# EAGLE design Millable_TitanX1_GPS_Breakout (EAGLE 7.7.0)
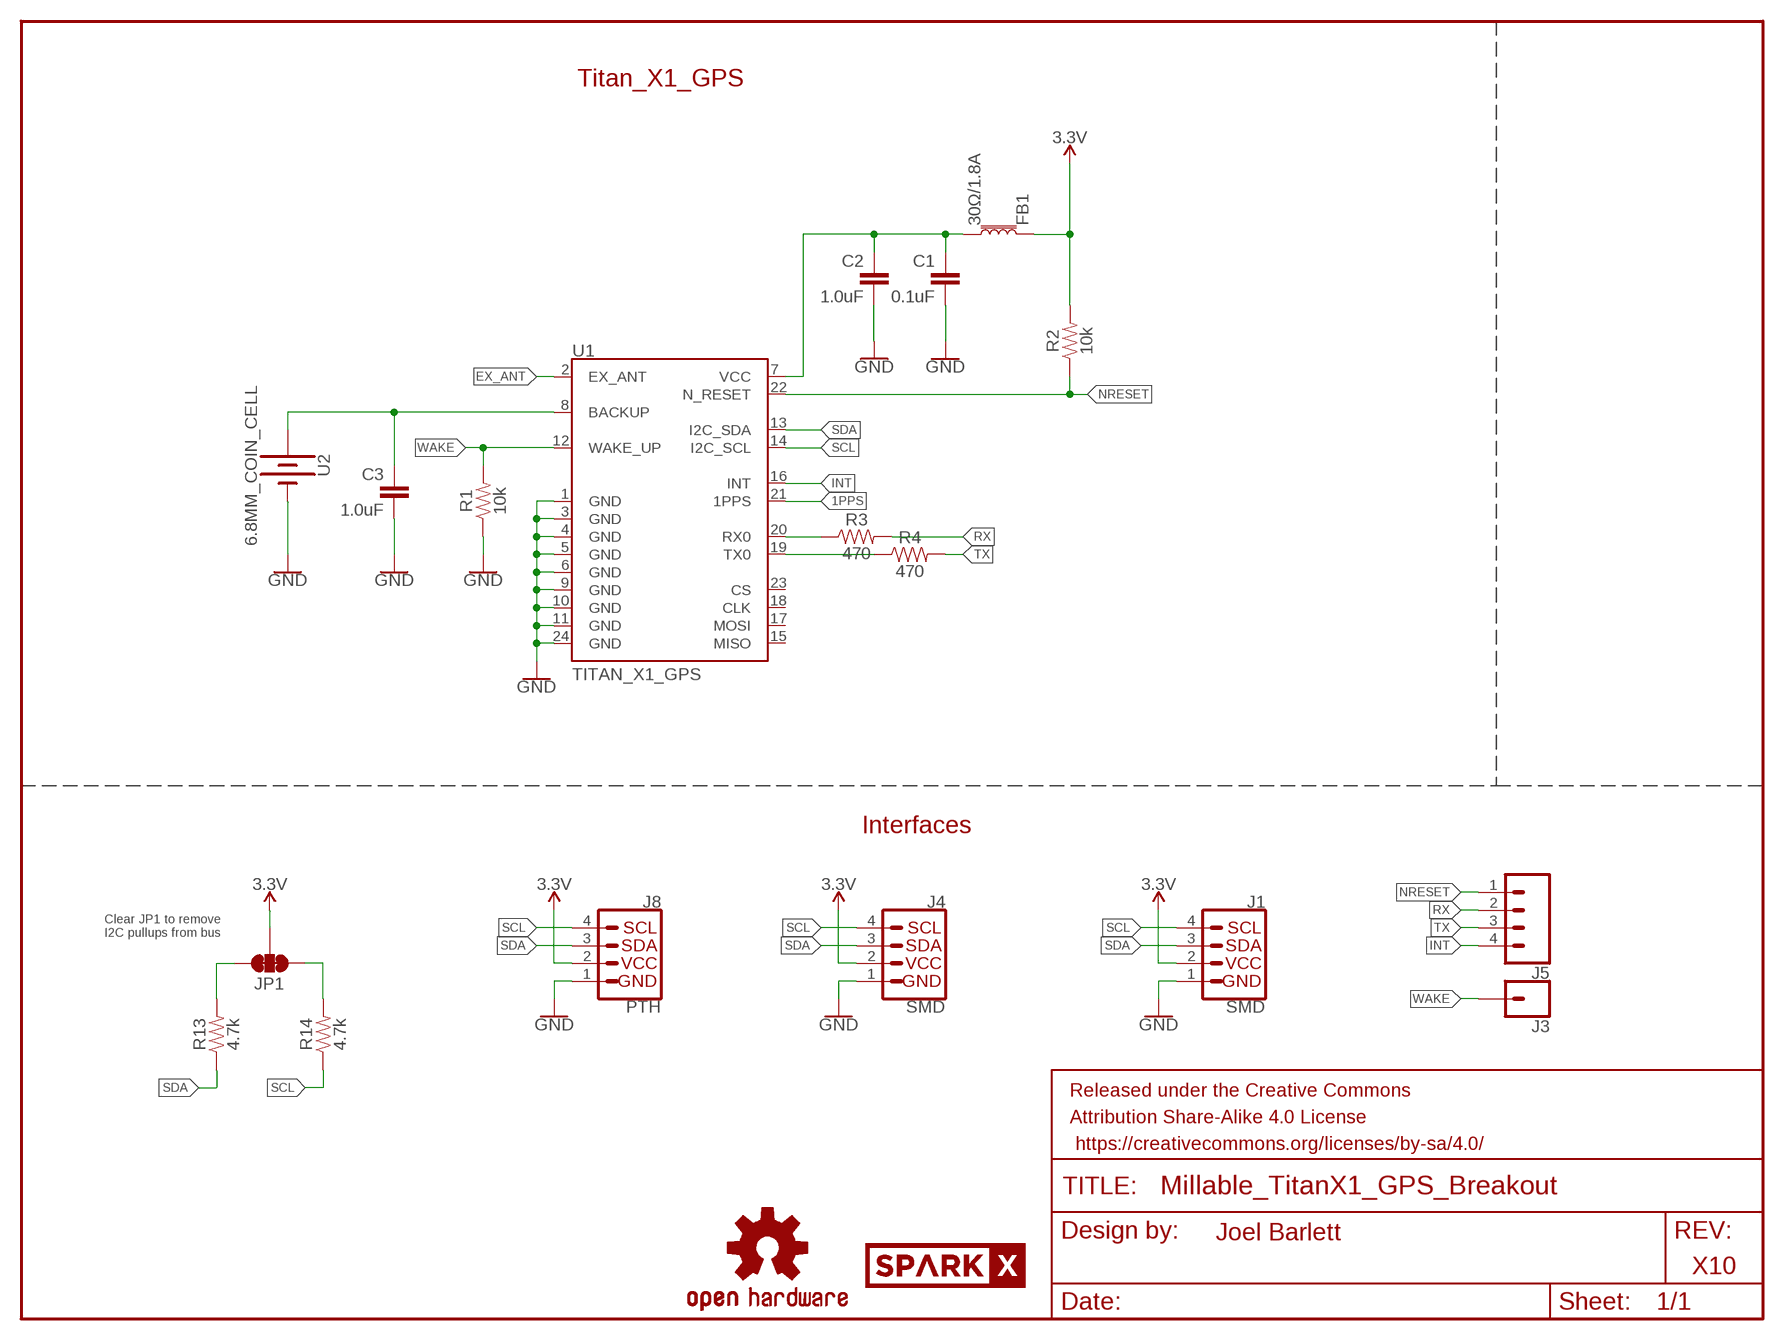
[diagram p0: schematic, sheet 1]

## Parts
C1  0.1uF  0.1UF-0603-25V-(+80/-20%)  [0603]
C2  1.0uF  1.0UF-0603-16V-10%  [0603]
C3  1.0uF  1.0UF-0603-16V-10%  [0603]
FB1  30Ω/1.8A  FERRITE_BEAD-0603  [0603]
FRAME1  FRAME-LETTER  [CREATIVE_COMMONS]
J1  SMD  I2C_STANDARDJS-1MM  [1X04_1MM_RA]
J3  CONN_01PTH_NO_SILK_YES_STOP  [1X01_NO_SILK]
J4  SMD  I2C_STANDARDJS-1MM  [1X04_1MM_RA]
J5  CONN_041X04_NO_SILK  [1X04_NO_SILK]
J8  PTH  I2C_STANDARD_NO_SILK  [1X04_NO_SILK]
JP1  JUMPER-SMT_3_2-NC_TRACE_SILK  [SMT-JUMPER_3_2-NC_TRACE_SILK]
LOGO4  OSHW-LOGOS  [OSHW-LOGO-S]
R1  10k  10KOHM-0603-1/10W-1%  [0603]
R2  10k  10KOHM-0603-1/10W-1%  [0603]
R3  470  470OHM-0603-1/10W-1%  [0603]
R4  470  470OHM-0603-1/10W-1%  [0603]
R13  4.7k  4.7KOHM-0603-1/10W-1%  [0603]
R14  4.7k  4.7KOHM-0603-1/10W-1%  [0603]
U1  TITAN_X1_GPS  [TITAN_X1_GPS]
U2  6.8MM_COIN_CELL  [6.8MM_COIN_CELL]
U$1  SPARKX-LOGO3  [SPARKX-SMALL]

## Nets
1PPS: U1.21(1PPS)
3.3V: FB1.1 J1.2(VCC) J4.2(VCC) J8.2 JP1.2 R2.2
EX_ANT: U1.2(EX_ANT)
GND: C1.2 C2.2 C3.2 J1.1(GND) J4.1(GND) J8.1 R1.1 U1.1(GND) U1.3(GND) U1.4(GND) U1.5(GND) U1.6(GND) U1.9(GND) U1.10(GND) U1.11(GND) U1.24(GND) U2.-
INT: J5.4 U1.16(INT)
N$1: C3.1 U1.8(BACKUP) U2.+
N$3: R3.1 U1.20(RX0)
N$4: JP1.3 R13.2
N$5: JP1.1 R14.2
N$6: R4.1 U1.19(TX0)
N$7: C1.1 C2.1 FB1.2 U1.7(VCC)
NRESET: J5.1 R2.1 U1.22(N_RESET)
RX: J5.2 R3.2
SCL: J1.4(SCL) J4.4(SCL) J8.4 R14.1 U1.14(I2C_SCL)
SDA: J1.3(SDA) J4.3(SDA) J8.3 R13.1 U1.13(I2C_SDA)
TX: J5.3 R4.2
WAKE: J3.1 R1.2 U1.12(WAKE_UP)
Unconnected: U1.15(MISO) U1.17(MOSI) U1.18(CLK) U1.23(CS)

## Notes on the sheet
- Titan_X1_GPS
- Interfaces
- Clear JP1 to remove
  I2C pullups from bus
- Joel Barlett
- X10

## Library data of the parts
C1 = SparkFun-Capacitors:0.1UF: 0.1µF ceramic capacitors A capacitor is a passive two-terminal electrical component used to store electrical energy temporarily in an electric field.; PROD_ID: CAP-00810
C2 C3 = SparkFun-Capacitors:1.0UF: 1µF ceramic capacitors A capacitor is a passive two-terminal electrical component used to store electrical energy temporarily in an electric field.; PROD_ID: CAP-00868
FB1 = SparkFun-Coils:FERRITE_BEAD: Ferrite Bead (blocks, cores, rings, chokes, etc.) Inductor with layers of ferrite used to suppress high frequencies. Often used to isolate high frequency noise. SparkFun Products: IOIO-OTG - V2.2 <https://www.sparkfun.com/products/13613> SparkFun SAMD21 Mini Breakout <https://www.sparkfun.com/products/13664> SparkFun 6 Degrees of Freedom Breakout - LSM6DS3 <https://www.sparkfun.com/products/13339> SparkFun SAMD21 Dev Breakout <https://www.sparkfun.com/products/13672>; PROD_ID: NDUC-07859
FRAME1 = SparkFun-Aesthetics:FRAME-LETTER: Schematic Frame - Letter Standard 8.5x11 US Letter frame
J1 J4 = SparkX:I2C_STANDARD: SparkFun I2C Standard Pinout Header SparkFun has standardized on a pinout for all I2C based sensor breakouts. This pinout allows I2C boards to be plugged directly into the headers on Arduino Uno compatible boards, and to be daisy chained easily. Example SparkFun Products: SparkFun Atmospheric Sensor Breakout - BME280 <https://www.sparkfun.com/products/13676> SparkFun Altitude/Pressure Sensor Breakout - MPL3115A2 <https://www.sparkfun.com/products/11084> SparkFun TOF Range Finder Sensor - VL6180 <https://www.sparkfun.com/products/12785>
J3 = SparkFun-Connectors:CONN_01: Single connection point. Often used as Generic Header-pin footprint for 0.1 inch spaced/style header connections On any of the 0.1 inch spaced packages, you can populate with these: Break Away Headers - Straight <https://www.sparkfun.com/products/116> (PRT-00116) Break Away Male Headers - Right Angle <https://www.sparkfun.com/products/553> (PRT-00553) Female Headers <https://www.sparkfun.com/products/115> (PRT-00115) Break Away Headers - Machine Pin <https://www.sparkfun.com/products/117> (PRT-00117) Break Away Female Headers - Swiss Machine Pin <https://www.sparkfun.com/products/743> (PRT-00743) This device is also useful as a general connection point to wire up your design to another part of your project. Our various solder wires solder well into these plated through hole pads. Hook-Up Wire - Assortment (Stranded, 22 AWG) <https://www.sparkfun.com/products/11375> (PRT-11375) Hook-Up Wire - Assortment (Solid Core, 22 AWG) <https://www.sparkfun.com/products/11367> (PRT-11367) View the entire wire category on our website here <https://www.sparkfun.com/categories/141> Special notes: SMTSO-256-ET is a "flush mount" nut for a 4-40 screw. We mostly use this on specialty testbeds; it is a nice way to connect hardware to your PCB at an adjustable hieght. Also note, the SNAP packages are for using a snappable style connector. We sell a baggie of snaps and they are also used on two LilyPad designs: Snap Assortment - 30 pack (male and female) <https://www.sparkfun.com/products/11347> (DEV-11347) LilyPad Arduino SimpleSnap <https://www.sparkfun.com/products/10941> (DEV-10941) LilyPad SimpleSnap Protoboard <https://www.sparkfun.com/products/10940> (DEV-10940)
J5 = SparkFun-Connectors:CONN_04: Multi connection point. Often used as Generic Header-pin footprint for 0.1 inch spaced/style header connections On any of the 0.1 inch spaced packages, you can populate with these: Break Away Headers - Straight <https://www.sparkfun.com/products/116> (PRT-00116) Break Away Male Headers - Right Angle <https://www.sparkfun.com/products/553> (PRT-00553) Female Headers <https://www.sparkfun.com/products/115> (PRT-00115) Break Away Headers - Machine Pin <https://www.sparkfun.com/products/117> (PRT-00117) Break Away Female Headers - Swiss Machine Pin <https://www.sparkfun.com/products/743> (PRT-00743) For SCREWTERMINALS and SPRING TERMINALS visit here: Screw Terimnals on SparkFun.com <https://www.sparkfun.com/search/results?term=Screw+Terminals> (5mm/3.5mm/2.54mm spacing) This device is also useful as a general connection point to wire up your design to another part of your project. Our various solder wires solder well into these plated through hole pads. Hook-Up Wire - Assortment (Stranded, 22 AWG) <https://www.sparkfun.com/products/11375> (PRT-11375) Hook-Up Wire - Assortment (Solid Core, 22 AWG) <https://www.sparkfun.com/products/11367> (PRT-11367) View the entire wire category on our website here <https://www.sparkfun.com/categories/141> Special notes: Molex polarized connector foot print use with SKU : PRT-08231 with associated crimp pins and housings. 1MM SMD Version SKU: PRT-10208; PROD_ID: CONN-09696
J8 = SparkFun-Connectors:I2C_STANDARD: SparkFun I2C Standard Pinout Header SparkFun has standardized on a pinout for all I2C based sensor breakouts. This pinout allows I2C boards to be plugged directly into the headers on Arduino Uno compatible boards, and to be daisy chained easily. Example SparkFun Products: SparkFun Atmospheric Sensor Breakout - BME280 <https://www.sparkfun.com/products/13676> SparkFun Altitude/Pressure Sensor Breakout - MPL3115A2 <https://www.sparkfun.com/products/11084> SparkFun TOF Range Finder Sensor - VL6180 <https://www.sparkfun.com/products/12785>
JP1 = SparkFun-Jumpers:JUMPER-SMT_3_2-NC_TRACE: Normally closed trace jumper (2 of 2 connections) This jumper has a trace between all three pads so they are normally closed (NC). Use a razor knife to open the connection(s). For best results follow the IPC guidelines for cutting traces: Cutout at least 0.063 mm (0.005 in). Remove all loose material to clean up the cut area. Seal the cut with an approved epoxy. Reapply solder to reclose the connection(s).
LOGO4 = SparkFun-Aesthetics:OSHW-LOGO: Open-Source Hardware (OSHW) Logo This logo indicates the piece of hardware it is found on incorporates a OSHW license and/or adheres to the definition of open source hardware found here: http://freedomdefined.org/OSHW
R1 R2 = SparkFun-Resistors:10KOHM: 10kΩ resistor A resistor is a passive two-terminal electrical component that implements electrical resistance as a circuit element. Resistors act to reduce current flow, and, at the same time, act to lower voltage levels within circuits. - Wikipedia; PROD_ID: RES-00824
R3 R4 = SparkFun-Resistors:470OHM: 470Ω resistor A resistor is a passive two-terminal electrical component that implements electrical resistance as a circuit element. Resistors act to reduce current flow, and, at the same time, act to lower voltage levels within circuits. - Wikipedia; PROD_ID: RES-07869
R13 R14 = SparkFun-Resistors:4.7KOHM: 4.7kΩ resistor A resistor is a passive two-terminal electrical component that implements electrical resistance as a circuit element. Resistors act to reduce current flow, and, at the same time, act to lower voltage levels within circuits. - Wikipedia; PROD_ID: RES-07857
U1 = SparkX:TITAN_X1_GPS
U2 = SparkX:6.8MM_COIN_CELL
U$1 = SparkX:SPARKX-LOGO

## Board
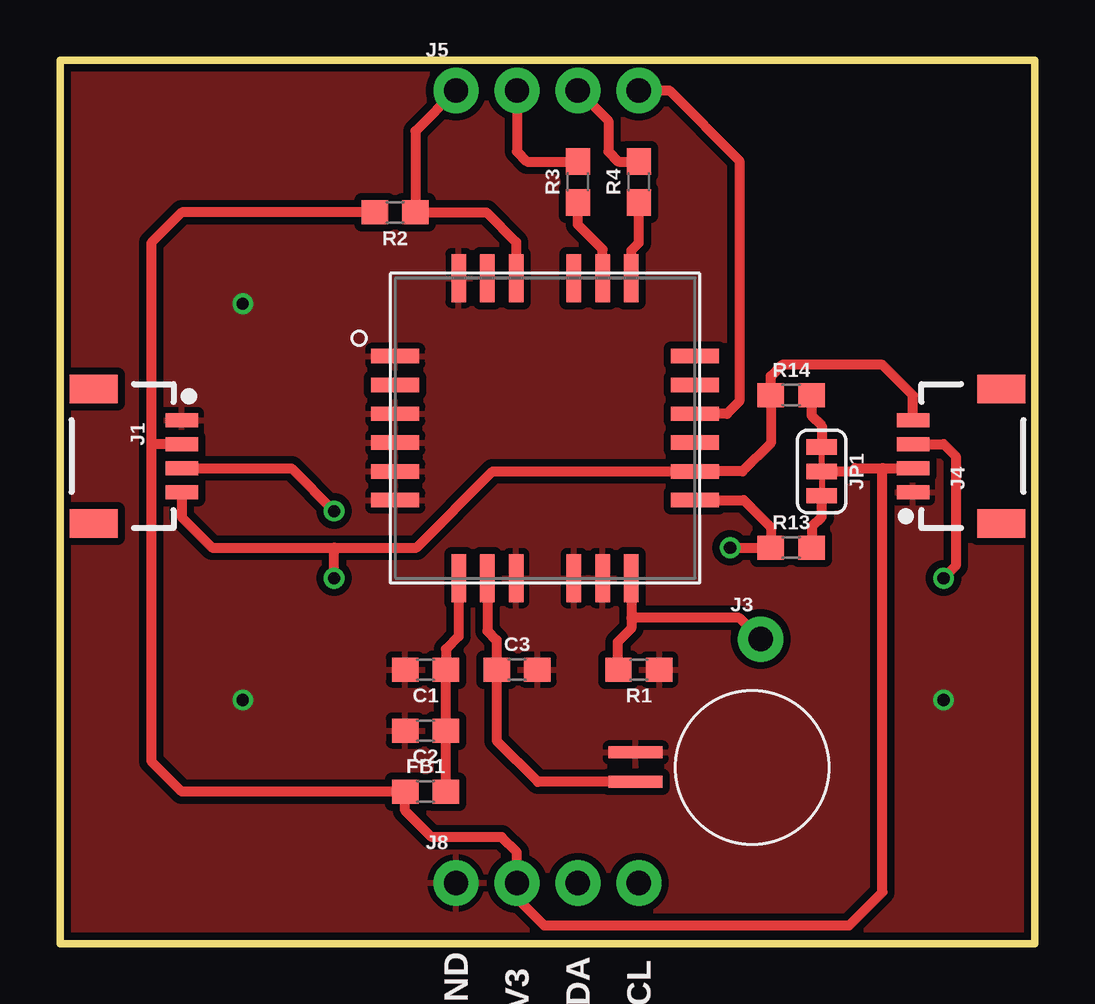
[diagram p1: board, top side]
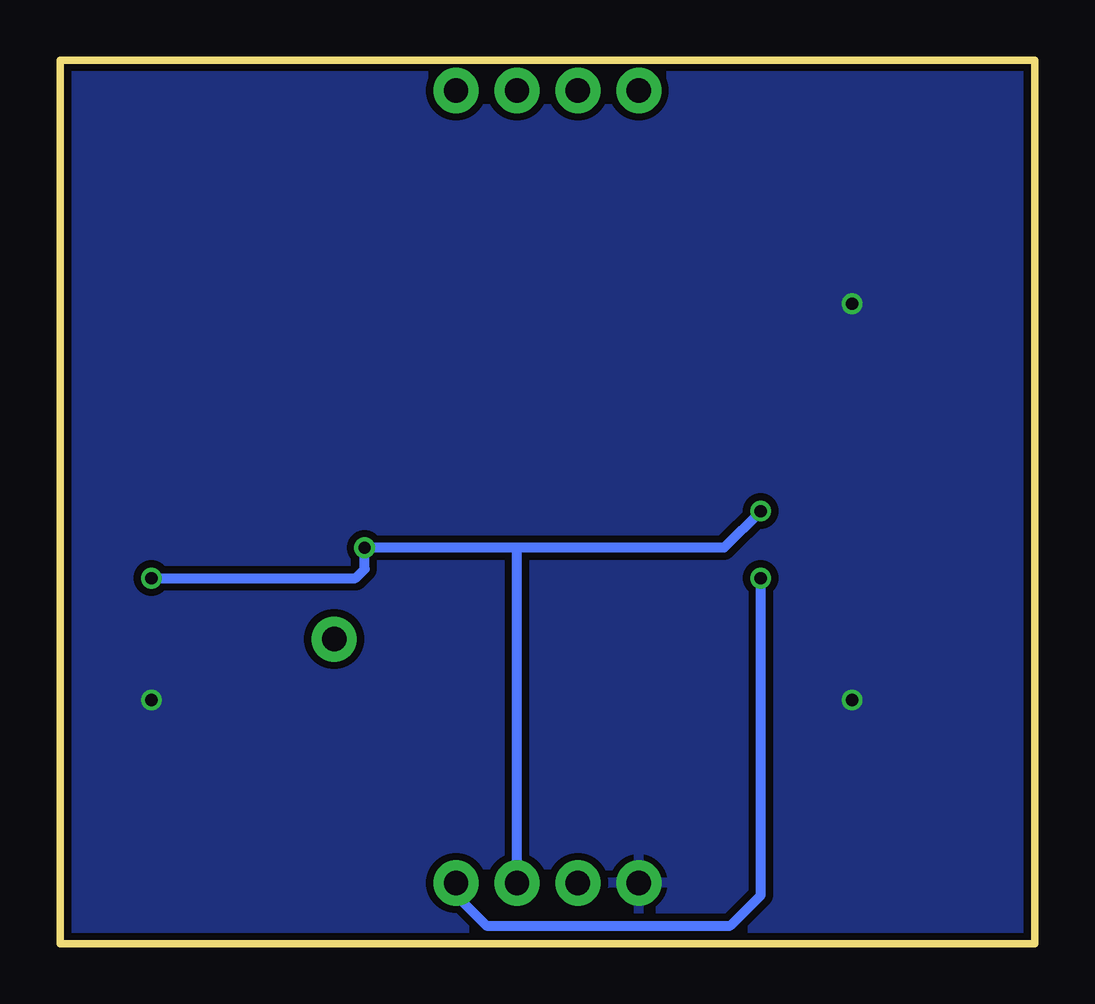
[diagram p2: board, bottom side, seen from below]

Size 40.64 x 36.83 mm. Coordinates in mm from the lower left corner, seen from the top.
Outline: 0,0 0,36.83 40.64,36.83 40.64,0 0,0
Copper layers (1*16): Top 0.035mm / dielectric 1.5mm / Bottom 0.035mm
Design rules "SparkFun-2-layer-TIGHT": minimum track width 7mil, minimum drill 15mil, track to track 7mil, track to pad 7mil, pad to pad 7mil, via to via 7mil, smd to smd 7mil, copper to edge 7mil, drill to drill 7mil, minimum pad ring 7mil, minimum via ring 7mil, stop-mask expansion 4mil, vias tented up to drill 25mil, thermal gap 10mil

### Footprints (pad centres in the part's own frame; a part is rotated, then mirrored left to right if it is on the bottom)
0603 = smd 1.1 x 1: 1 -0.85,0; 2 0.85,0
1X04_1MM_RA = smd 0.6 x 1.35: 1 -1.5,0; 2 -0.5,0; 3 0.5,0; 4 1.5,0 | smd 1.2 x 2: NC1 2.8,-3.675; NC2 -2.8,-3.675
1X01_NO_SILK = drill 1.016 pad 1.88: 1 0,0
1X04_NO_SILK = drill 1.016 pad 1.88: 1 0,0; 2 2.54,0; 3 5.08,0; 4 7.62,0
SMT-JUMPER_3_2-NC_TRACE_SILK = smd 0.635 x 1.27: 1 -1.016,0; 2 0,0; 3 1.016,0
TITAN_X1_GPS = smd 2 x 0.6: 1 -6.35,2.9; 2 -6.35,1.7; 3 -6.35,0.5; 4 -6.35,-0.7; 5 -6.35,-1.9; 6 -6.35,-3.1; 13 6.15,-3.1; 14 6.15,-1.9; 15 6.15,-0.7; 16 6.15,0.5; 17 6.15,1.7; 18 6.15,2.9 | smd 0.6 x 2: 7 -3.7,-6.35; 8 -2.5,-6.35; 9 -1.3,-6.35; 10 1.1,-6.35; 11 2.3,-6.35; 12 3.5,-6.35; 19 3.5,6.15; 20 2.3,6.15; 21 1.1,6.15; 22 -1.3,6.15; 23 -2.5,6.15; 24 -3.7,6.15
6.8MM_COIN_CELL = smd 2.25 x 0.5: + 1.13,0.4; - 1.13,1.63

### Placement (x,y rotation side)
C1  15.24,11.43 180 top
C2  15.24,8.89 180 top
C3  19.05,11.43 0 top
FB1  15.24,6.35 0 top
FRAME1  -13.97,-21.59 0 top  (outside the outline)
J1  [1X04_1MM_RA]  5.08,20.32 270 top
J3  29.21,12.7 0 top
J4  [1X04_1MM_RA]  35.56,20.32 90 top
J5  16.51,35.56 0 top
J8  [1X04_NO_SILK]  16.51,2.54 0 top
JP1  31.75,19.68 270 top
LOGO4  19.05,40.64 0 bottom  (outside the outline)
R1  24.13,11.43 180 top
R2  13.97,30.48 180 top
R3  21.59,31.75 90 top
R4  24.13,31.75 90 top
R13  30.48,16.51 0 top
R14  30.48,22.86 0 top
U1  20.32,21.59 0 top
U2  22.86,6.35 0 top
U$1  12.45,40.64 0 top  (outside the outline)

### Tracks (layer width: path | path; a pad name or v marks a point on that pad's centre or on a via)
3.3V
  Top 0.406: J1.2 3.81,20.83 | JP1.2 33.02,19.68 33.16,19.82 34.29,19.82 | 34.29,19.82 J4.2 | 3.81,20.83 3.81,7.62 5.08,6.35 FB1.1 14.39,5.55 15.49,4.45 18.41,4.45 19.05,3.81 J8.2 19.05,1.91 20.19,0.76 32.89,0.76 34.29,2.16 34.29,19.82 | R2.2 5.08,30.48 3.81,29.21 3.81,20.83
GND  (via drill 0.51)
  other vias: 7.62,10.16 7.62,26.67 36.83,10.16
  pour Top (isolate 0.305): 0,36.83 0,0 40.64,0 40.64,36.83
  pour Bottom (isolate 0.305): 0,36.83 0,0 40.64,0 40.64,36.83
INT
  Top 0.406: U1.16 27.8,22.09 28.32,22.61 28.32,32.64 25.4,35.56 J5.4
N$1
  Top 0.406: U1.8 17.82,13.04 18.2,12.66 C3.1 18.2,8.47 19.92,6.75 U2.+
N$3
  Top 0.406: U1.20 22.62,28.94 21.59,29.97 R3.1
N$4
  Top 0.406: R13.2 31.37,16.55 31.37,17.4 31.75,17.78 JP1.3
N$5
  Top 0.406: R14.2 31.33,22.01 31.75,21.59 JP1.1
N$6
  Top 0.406: U1.19 23.82,28.9 24.13,29.21 R4.1
N$7
  Top 0.406: FB1.2 C2.1 C1.1 16.09,12.28 16.62,12.81 U1.7
NRESET
  Top 0.406: 19.05,27.74 U1.22 19.02,29.24 17.78,30.48 R2.1 14.82,33.87 J5.1
RX
  Top 0.406: J5.2 19.05,33.02 19.47,32.6 R3.2
SCL  (via drill 0.51)
  Top 0.406: U1.14 28.45,19.68 29.63,20.87 R14.1 29.63,23.66 30.1,24.13 34.29,24.13 35.56,22.86 J4.4 | J1.4 5.08,17.78 6.35,16.51 11.43,16.51 | 11.43,16.51 14.86,16.51 18.04,19.69 U1.14 | 24.14,19.69 U1.14 | v11.43,15.24 11.43,16.51
  Bottom 0.406: v11.43,15.24 11.43,2.03 12.7,0.76 22.86,0.76 24.13,2.03 J8.4
SDA  (via drill 0.51)
  Top 0.406: U1.13 28.5,18.49 29.63,17.36 R13.1 v27.94,16.51 | J1.3 9.65,19.81 v11.43,18.03 | J4.3 36.84,20.82 37.34,20.32 37.34,15.75 v36.83,15.24
  Bottom 0.406: v11.43,18.03 12.95,16.51 21.59,16.51 | 21.59,16.51 v27.94,16.51 27.94,15.62 28.32,15.24 v36.83,15.24 | J8.3 21.59,16.51
TX
  Top 0.406: R4.2 23.28,32.6 22.86,33.02 22.86,34.29 J5.3
WAKE
  Top 0.406: U1.12 23.82,13.59 | 23.82,13.59 23.82,13.15 23.24,12.57 23.24,11.47 R1.2 | J3.1 28.32,13.59 23.82,13.59

### Text on the board
tPlace: GND | 3V3 | SDA | SCL
tDocu: Joel Bartlett